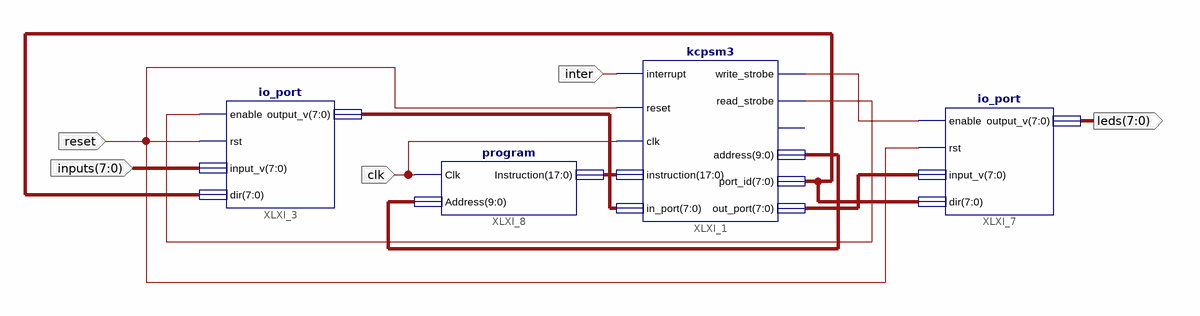
[diagram p0: schematic sheet 1]
// Xilinx ISE schematic todo.sch (spartan3e) as structural Verilog: 4 symbols, 5 ports
module todo (
  input  reset,
  input  [7:0] inputs,
  input  clk,
  input  inter,
  output [7:0] leds
);

  wire XLXN_6, XLXN_14;
  wire [7:0] XLXN_3, XLXN_4, XLXN_21;
  wire [9:0] XLXN_2;
  wire [17:0] XLXN_1;

  kcpsm3 XLXI_1 (
    .interrupt(inter), .reset(reset), .clk(clk), .instruction(XLXN_1), .in_port(XLXN_3),
    .write_strobe(XLXN_6), .read_strobe(XLXN_14), .address(XLXN_2), .port_id(XLXN_4), .out_port(XLXN_21));  // open: interrupt_ack
  io_port XLXI_3 (.enable(XLXN_14), .rst(reset), .input_v(inputs), .dir(XLXN_4), .output_v(XLXN_3));
  io_port XLXI_7 (.enable(XLXN_6), .rst(reset), .input_v(XLXN_21), .dir(XLXN_4), .output_v(leds));
  \program  XLXI_8 (.Clk(clk), .Address(XLXN_2), .Instruction(XLXN_1));
endmodule
